# Altium schematic sheet USF-IEEE-CS.SchDoc
size A4; SheetNumber: 1; SheetTotal: 1
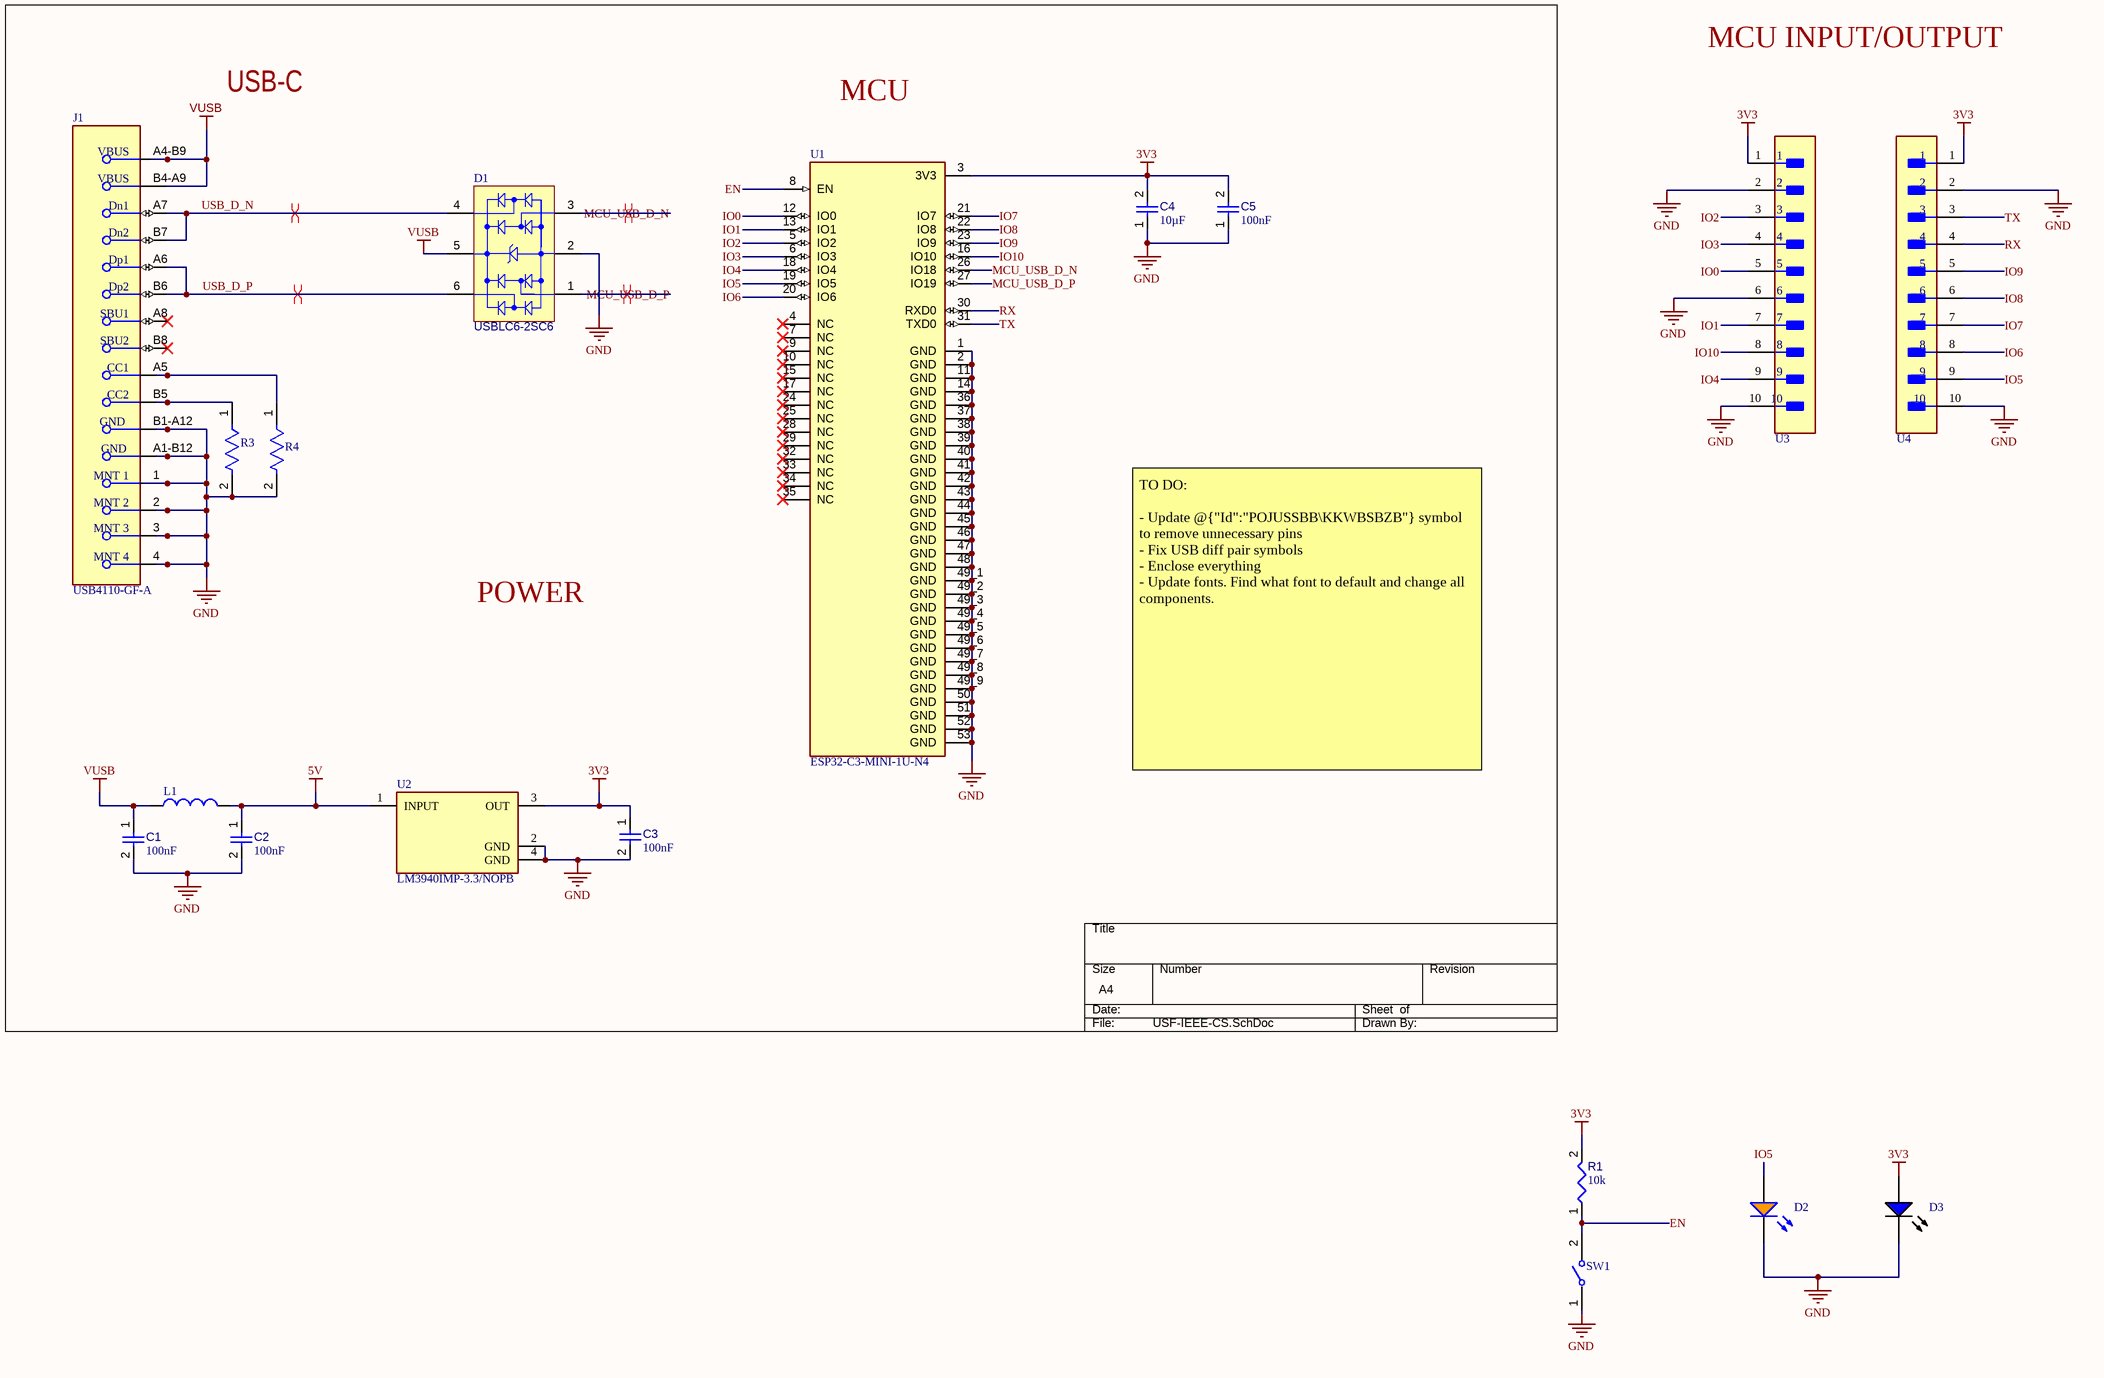
[diagram p0: USF-IEEE-CS.SchDoc]

## Parts
C1  value 100nF  [CAPC1608X90X40NL10T20]  (hidden comment: Capacitor 100 nF +/-10% 50 V 0603)
C2  value 100nF  [CAPC1608X90X40NL10T20]  (hidden comment: Capacitor 100 nF +/-10% 50 V 0603)
C3  value 100nF  [CAPC1608X90X40NL10T20]  (hidden comment: Capacitor 100 nF +/-10% 50 V 0603)
C4  value 10µF  [CAPC0603(1608)100_L]  (hidden comment: Capacitor 10µF +/-20% 10V 0603)
C5  value 100nF  [CAPC1608X90X40NL10T20]  (hidden comment: Capacitor 100 nF +/-10% 50 V 0603)
D1  USBLC6-2SC6  [STM-SOT23-6L_V]
D2  LTST-C190AKT  [LTST-C190AKT-2_V]  (value not drawn)
D3  LTST-C190TBKT  [LTST-C190TBKT-2_V]  (value not drawn)
J1  USB4110-GF-A  [FP-USB4110-GF-A-MFG]
L1  LQG18HN2N2S00D  [FP-LQG18HH_00-IPC_A]  (value not drawn)
R1  value 10k  [RESC1608X55X25ML10T15]  (hidden comment: Resistor 10k +/-1% 0603 100 mW)
R3  ERA-3AEB512V  [FP-ERA3A-MFG]  (value not drawn)
R4  ERA-3AEB512V  [FP-ERA3A-MFG]  (value not drawn)
SW1  B3U-1000P  [FP-B3U-1000P-MFG]  (value not drawn)
U1  ESP32-C3-MINI-1U-N4  [XCVR_ESP32-C3-MINI-1U-N4]
U2  LM3940IMP-3.3/NOPB  [FP-DCY0004A-IPC_C]
U3  61301011121  [FP-61301011121-MFG]  (value not drawn)
U4  61301011121  [FP-61301011121-MFG]  (value not drawn)

## Nets
3V3: C3.1 C4.2 C5.2 D3.1(A) R1.2 U1.3(3V3) U2.3(OUT) U3.1 U4.1
5V: C2.1 L1.2 U2.1(INPUT)
GND: C1.2 C2.2 C3.2 C4.1 C5.1 D1.2(GND) D2.2(K) D3.2(K) J1.1(MNT_1) J1.2(MNT_2) J1.3(MNT_3) J1.4(MNT_4) J1.A1-B12(GND) J1.B1-A12(GND) R3.2 R4.2 SW1.1 U1.1(GND) U1.2(GND) U1.11(GND) U1.14(GND) U1.36(GND) U1.37(GND) U1.38(GND) U1.39(GND) U1.40(GND) U1.41(GND) U1.42(GND) U1.43(GND) U1.44(GND) U1.45(GND) U1.46(GND) U1.47(GND) U1.48(GND) U1.49_1(GND) U1.49_2(GND) U1.49_3(GND) U1.49_4(GND) U1.49_5(GND) U1.49_6(GND) U1.49_7(GND) U1.49_8(GND) U1.49_9(GND) U1.50(GND) U1.51(GND) U1.52(GND) U1.53(GND) U2.2(GND) U2.4(GND) U3.2 U3.6 U3.10 U4.2 U4.10
VUSB: C1.1 D1.5(VBUS) J1.A4-B9(VBUS) J1.B4-A9(VBUS) L1.1
EN: R1.1 SW1.2 U1.8(EN)
IO0: U1.12(IO0) U3.5
IO1: U1.13(IO1) U3.7
IO2: U1.5(IO2) U3.3
IO3: U1.6(IO3) U3.4
IO4: U1.18(IO4) U3.9
IO5: D2.1(A) U1.19(IO5) U4.9
IO6: U1.20(IO6) U4.8
IO7: U1.21(IO7) U4.7
IO8: U1.22(IO8) U4.6
IO9: U1.23(IO9) U4.5
IO10: U1.16(IO10) U3.8
MCU_USB_D_N: D1.3(I/O_2) U1.26(IO18)
MCU_USB_D_P: D1.1(I/O_1) U1.27(IO19)
RX: U1.30(RXD0) U4.4
TX: U1.31(TXD0) U4.3
USB_D_N: D1.4(I/O_3) J1.A7(Dn1) J1.B7(Dn2)
USB_D_P: D1.6(I/O_4) J1.A6(Dp1) J1.B6(Dp2)
NetJ1_A5: J1.A5(CC1) R4.1
NetJ1_B5: J1.B5(CC2) R3.1

Not connected (* = marked no-connect by the designer): J1 A8(SBU1)* B8(SBU2)*; U1 4(NC)* 7(NC)* 9(NC)* 10(NC)* 15(NC)* 17(NC)* 24(NC)* 25(NC)* 28(NC)* 29(NC)* 32(NC)* 33(NC)* 34(NC)* 35(NC)*

## Layout directives
differential pair: MCU_USB_D_N, MCU_USB_D_P, USB_D_N, USB_D_P

## Notes on the sheet
- USB-C
- MCU
- MCU INPUT/OUTPUT
- POWER
- TO DO:
  - Update @{"Id":"POJUSSBB\KKWBSBZB"} symbol to remove unnecessary pins
  - Fix USB diff pair symbols
  - Enclose everything
  - Update fonts. Find what font to default and change all components.
- DWG. NO.
- REV.
- SHT.
- THIS DOCUMENT AND THE DATA DISCLOSED HEREIN OR HEREWITH IS THE PROPERTY OF ALTIUM LIMITED AND MAY BE FREELY DISTRIBUTED IN WHOLE. NO RIGHTS ARE RESERVED OR EXPRESS OR IMPLIED WARANTEE GIVEN.
- REVISION
- DESCRIPTION
- DATE
- APPROVED
- ENG:
- APPROVALS
- PROJECT
- DSN:
- CHK:
- REFERENCE DOCUMENTS
- PROJECT REVISION:
- TITLE
- DOCUMENT REVISION:
- DESIGN ITEM:
- BOM:
- FAB DWG:
- PCB DWG:
- ASSY DWG:
- SCALE:
- SIZE
- B
- CAGE CODE
- FILE NAME
- DWG NO.
- SHEET
- OF
- REV

## Library data of the parts
C1-C3 C5 = CMP-001-00017-6: Chip Capacitor, 100 nF, +/- 10%, 50 V, 0603 (1608 Metric); Voltage Rating: 50V; Capacitor Type: Ceramic; Tolerance: 10%; Mounting Technology: SM; Max Operating Temperature: 125°C; RoHS Compliant: True; Pins: 2; Case/Package: 0603; Min Operating Temperature: -55°C
C4 = CMP-001-00075-5: Chip Capacitor, 10µF +/-20%, 10V, 0603, Thickness 1 mm; Tolerance: 10%; Voltage Rating: 10V; Max Operating Temperature: 85°C; Pins: 2; Case/Package: 0603; Mounting Technology: SMT; Min Operating Temperature: -55°C
D1 = CMP-2000-05378-1: Very low capacitance ESD protection, 3.5 pF, -40 to 125 degC, 6-Pin SOT23, RoHS, Tape and Reel; Manufacturer: STMicroelectronics; Polarity: Uni-Directional; Clamping Voltage: 17V; Rad Hardened: No; Product Height (mm): 1.3mm; Leakage Current (Max): 0.15uA; Product Length (mm): 3.05mm; Number of Elements: 1; Peak Pulse Current: 5A; Configuration: Dual; Reverse Breakdown Voltage: 6V; Working Voltage (Max): 5V; Capacitance Value: 3.5pF; Suppressor Type: DiodeArrays; Product Depth (mm): 1.75mm; Test Current (It): 1mA; Package / Case: SOT-23; Operating Temperature Max Deg. C: 125C; Package Description: 6-Pin Small Outline Transistor, Body 2.925 x 1.625 mm, Pitch 0.95 mm; Package Reference: SOT23-6L; Datasheet Version: Rev. 5, 10/2011; Operating Temperature Min Deg. C: -40C; Mounting Style: SurfaceMount; Direction Type: Uni-Directional; Mounting: SurfaceMount; Pin Count: 6; Leakage Current: 0.15uA; Packaging: TapeandReel; Operating Temperature Classification: Automotive; Clamping Voltage (Max): 17V; Manufacturer URL: http://www.st.com/; Reverse Stand-off Voltage: 5V; Datasheet URL: http://www.st.com/st-web-ui/static/active/en/resource/technical/document/datasheet/CD00050750.pdf; Working Voltage: 5V; Operating Temp Range: -40Cto125C
D2 = CMP-007-00021-3: LED Uni-Color Orange, 100 mW, 30 mA, -55 to 85 degC, 2-Pin SMD, RoHS, Tape and Reel; Manufacturer: Lite-On; Lens Style: Clear; Forward Voltage: 2.1V; Luminous Intensity: 2mcd; Forward Current: 20mA; Viewing Angle: 130degrees; Package Reference: LTST-C190AKT-2; Case/Package: 0603; Min Operating Temperature: -55°C; Package Quantity: 3000; Illumination Colour: Orange; RoHS Compliant: True; Mounting Technology: SM; Manufacturer URL: http://www.us.liteon.com/; Datasheet URL: http://datasheet.octopart.com/LTST-C190AKT-Lite-On-datasheet-11729267.pdf; Pins: 2; Max Operating Temperature: 85°C; Packaging: TapeandReel; Colour: Orange; Nominal Vf: 2.1V; Datasheet Version: Jan-03; Package Description: 2-Pin Surface Mount Device, Body 1.6 x 0.8 mm
D3 = CMP-007-00026-3: LED Uni-Color Blue, 76 mW, 20 mA, -20 to 80 degC, 2-Pin SMD, RoHS, Tape and Reel; Manufacturer: Lite-On; Forward Voltage: 2.8V; Lens Style: Diffused; Luminous Intensity: 28mcd; Forward Current: 20mA; Viewing Angle: 130degrees; Nominal Vf: 3.3V; Packaging: TapeandReel; Min Operating Temperature: -20°C; Illumination Colour: Blue; Package Quantity: 3000; Pins: 2; Mounting Technology: SM; Package Reference: C190TBKT-2; Package Description: 2-Pin Surface Mount Device, Body 1.6 x 0.8 mm; RoHS Compliant: True; Datasheet URL: http://optoelectronics.liteon.com/upload/download/DS-22-99-0224/S_110_LTST-C190TBKT(0630).pdf; Datasheet Version: Rev. K, 08/2011; Manufacturer URL: http://www.us.liteon.com/; Colour: Blue; Case/Package: 0603; Max Operating Temperature: 80°C
J1 = CMP-002-00073-7: Conn USB Type C RCP 16 POS 0.3mm/0.5mm Solder ST SMD 16 Terminal 1 Port T/R
L1 = CMP-006-00021-1: General Purpose Inductor, 0.0022uH, 13.636%, 1 Element, Air-Core, SMD, 0603; Max Current Rating: 1.1A; Self Resonant Frequency: 6GHz; RoHS Compliant: Yes; Pins: 2; Max Operating Temperature: 85°C; Tolerance: 13.636%; Min Operating Temperature: -40°C
R1 = CMP-009-00017-5: Chip Resistor, 10 KOhm, +/- 1%, 01 W, -55 to 155 degC, 0603 (1608 Metric); Voltage Rating: 50V; Power: 100mW; RoHS Compliant: True; Min Operating Temperature: -55°C; Pins: 2; Case/Package: 0603; Mounting Technology: SM; Max Operating Temperature: 155°C; Tolerance: 1%
R3 R4 = CMP-009-00177-2: Res Thin Film 0603 5.1K Ohm 0.1% 1/10W ±25ppm/°C Molded SMD SMD Punched Carrier T/R
SW1 = CMP-2100-03586-2: SWITCH TACTILE SPST-NO 0.05A 12V; Contact Resistance: 100mR; Operating Force: 1.5N; Max Current Rating: 50mA; Switch Travel: 0.15mm; Actuator Type: Standard; Mechanical Life: 200000Cycles; Ratings: Dust Proof; Illumination Type: Non-Illuminated; Throw Configuration: SPST; Actuator Length: 0.4mm; Switch Function: Off-Mom; Height: 1.2mm; Width: 3mm; Weight: 0.000776oz; Contact Material: Silver; Max Voltage Rating (DC): 12V; Insulation Resistance: 100MR; Lead Free: Lead Free; Current Rating: 50mA; Termination: SMD/SMT; Length: 4mm; Voltage Rating (DC): 12V; Contact Current Rating: 50mA; Orientation: Straight; Depth: 2.5mm; Max Operating Temperature: 70°C; Packaging: Tape and Reel; Min Operating Temperature: -25°C; Package Quantity: 1; Mount: Surface Mount; Electrical Life: 200000Cycles
U1 = CMP-005-000000-4: Bluetooth, WiFi 802.11b/g/n, Bluetooth v5.0 Transceiver Module 2.412GHz ~ 2.484GHz Antenna Not Included, I-PEX Surface Mount; MF: Espressif Systems; Check_prices: https://www.snapeda.com/parts/ESP32-C3-MINI-1U-N4/Espressif+Systems/view-part/?ref=eda; SnapEDA_Link: https://www.snapeda.com/parts/ESP32-C3-MINI-1U-N4/Espressif+Systems/view-part/?ref=snap; Design Item ID: ESP32-C3-MINI-1U-N4; Package: None; Pin Count: 61; Price: None; Component Type: Standard; Purchase-URL: https://pricing.snapeda.com/search/part/ESP32-C3-MINI-1U-N4/?ref=eda; MP: ESP32-C3-MINI-1U-N4; Value: *; Availability: In Stock; Source: ESP32-C3-MINI-1U-N4.SchLib
U2 = CMP-019-00049-2: IC REG LDO 3.3V 1A SOT223
U3 U4 = CMP-002-00078-3: Board Connector, 10 Contact(s), 1 Row(s), Male, Straight, 0.1 inch Pitch, Solder Terminal, Locking, Black Insulator, Plug; Min Operating Temperature: -40°C; Mounting Technology: Board; RoHS Compliant: Yes; Max Operating Temperature: 125°C; Connector Type: BOARD CONNECTOR